# EAGLE schematic senseMini (EAGLE 9.1.1)
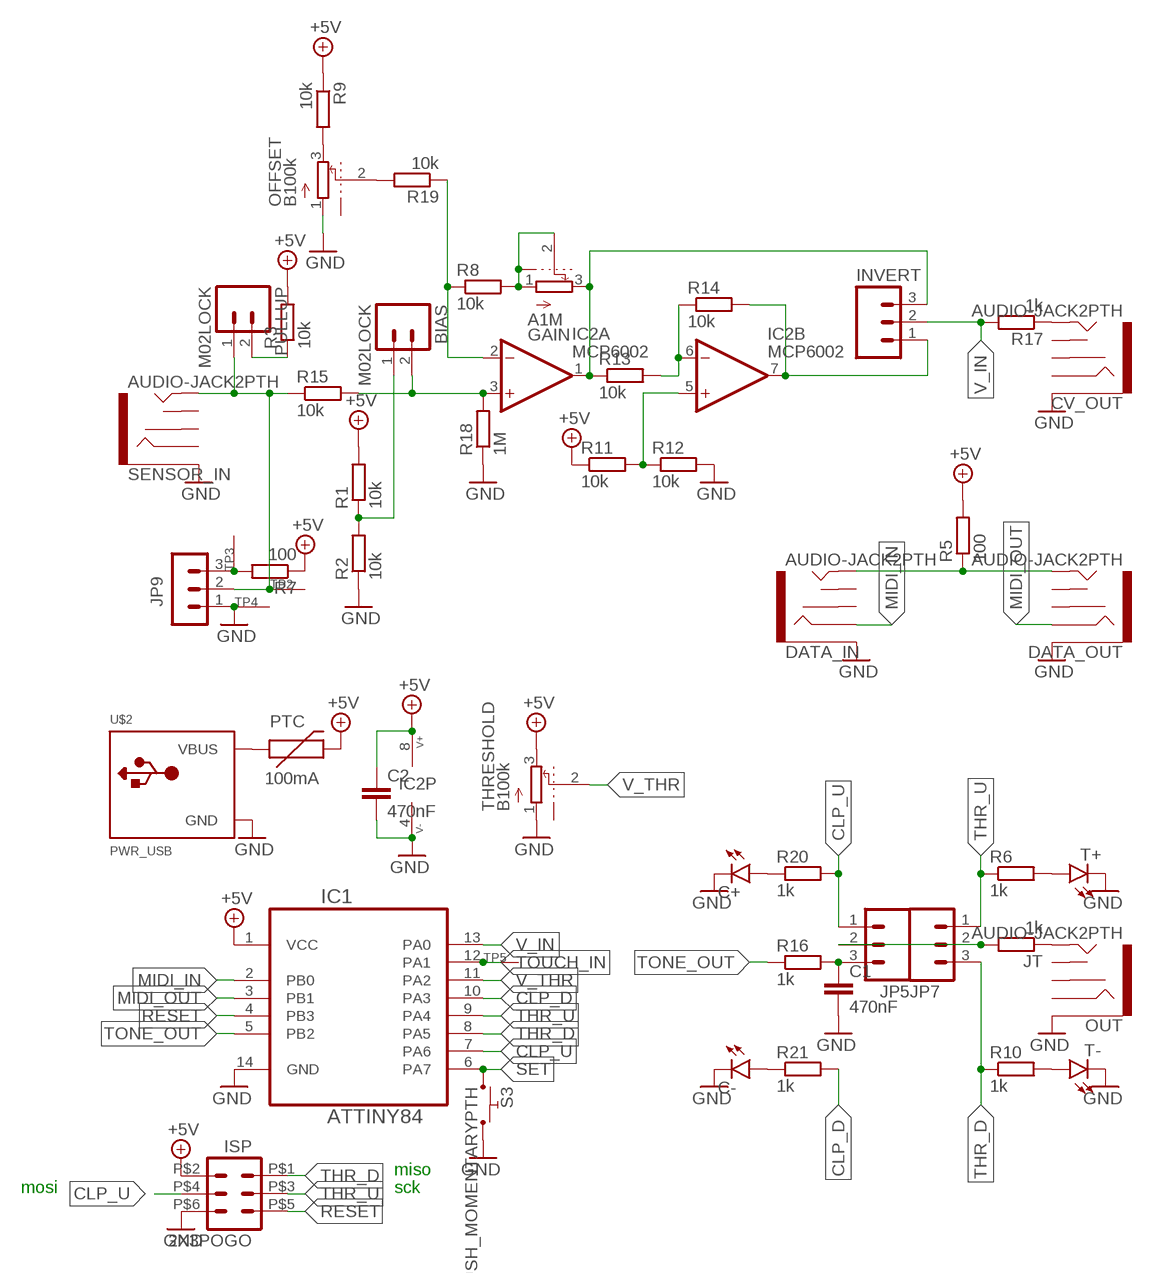
[diagram p0: schematic, sheet 1]

## Parts
BIAS  M02LOCK  [1X02_LOCK]
C1  470nF  CAPACITOR_CERAMIC_THT050-024X044  [C_C050-024X044]
C2  470nF  CAPACITOR_CERAMIC_THT050-024X044  [C_C050-024X044]
C+  LED_THT  [LEDSMALLHOLES]
C-  LED_THT  [LEDSMALLHOLES]
CV_OUT  AUDIO-JACK2PTH  [AUDIO-JACK]
DATA_IN  AUDIO-JACK2PTH  [AUDIO-JACK]
DATA_OUT  AUDIO-JACK2PTH  [AUDIO-JACK]
GAIN  A1M  POT_ALPHAPOT_ALPHA  [POT_ALPHA]
IC1  ATTINY84  ATTINY84-20PU  [DIP254P762X533-14]
IC2  MCP6002  TL072  [DIL08]
INVERT  M03LOCK  [1X03_LOCK]
ISP  2X3POGO  [2X3_POGO]
JP5  M03LOCK  [1X03_LOCK]
JP7  M03LOCK  [1X03_LOCK]
JP9  1X3_FEMALE  [HEADER_1X3_FEMALE]
JT  1k  RESISTOR_0204_THT0204/5  [RCL_0204/5]
OFFSET  B100k  POT_ALPHAPOT_ALPHA  [POT_ALPHA]
OUT  AUDIO-JACK2PTH  [AUDIO-JACK]
PTC  100mA  PTC_THTPTH  [PTC_THT]
PULLUP  M02LOCK  [1X02_LOCK]
R1  10k  RESISTOR_0204_THT0204/5  [RCL_0204/5]
R2  10k  RESISTOR_0204_THT0204/5  [RCL_0204/5]
R3  10k  RESISTOR_0204_THT0204/5  [RCL_0204/5]
R5  100  RESISTOR_0204_THT0204/5  [RCL_0204/5]
R6  1k  RESISTOR_0204_THT0204/5  [RCL_0204/5]
R7  100  RESISTOR_0204_THT0204/5  [RCL_0204/5]
R8  10k  RESISTOR_0204_THT0204/5  [RCL_0204/5]
R9  10k  RESISTOR_0204_THT0204/5  [RCL_0204/5]
R10  1k  RESISTOR_0204_THT0204/5  [RCL_0204/5]
R11  10k  RESISTOR_0204_THT0204/5  [RCL_0204/5]
R12  10k  RESISTOR_0204_THT0204/5  [RCL_0204/5]
R13  10k  RESISTOR_0204_THT0204/5  [RCL_0204/5]
R14  10k  RESISTOR_0204_THT0204/5  [RCL_0204/5]
R15  10k  RESISTOR_0204_THT0204/5  [RCL_0204/5]
R16  1k  RESISTOR_0204_THT0204/5  [RCL_0204/5]
R17  1k  RESISTOR_0204_THT0204/5  [RCL_0204/5]
R18  1M  RESISTOR_0204_THT0204/5  [RCL_0204/5]
R19  10k  RESISTOR_0204_THT0204/5  [RCL_0204/5]
R20  1k  RESISTOR_0204_THT0204/5  [RCL_0204/5]
R21  1k  RESISTOR_0204_THT0204/5  [RCL_0204/5]
S3  PUSH_MOMENTARYPTH  [TACTILE-PTH]
SENSOR_IN  AUDIO-JACK2PTH  [AUDIO-JACK]
T+  LED_THT  [LEDSMALLHOLES]
T-  LED_THT  [LEDSMALLHOLES]
THRESHOLD  B100k  POT_ALPHAPOT_ALPHA  [POT_ALPHA]
TP2  SEWTAP0.5IN  [SEWINGTAP_0.5]
TP3  SEWTAP0.5IN  [SEWINGTAP_0.5]
TP4  SEWTAP0.5IN  [SEWINGTAP_0.5]
TP5  SEWTAP0.5IN  [SEWINGTAP_0.5]
U$2  PWR_USB  [USBMICRO]

## Nets
+5V: C2.1 IC1.1(VCC) IC2.8(P:V+) ISP.P$2 PTC.P$2 R1.2 R3.2 R5.2 R7.1 R9.1 R11.1 THRESHOLD.3
CLP_D: IC1.10(PA3) R21.2
CLP_U: IC1.7(PA6) ISP.P$4 JP5.1 R20.2
GND: C1.2 C2.2 C+.K(C) C-.K(C) CV_OUT.SLEEVE DATA_IN.SLEEVE DATA_OUT.SLEEVE IC1.14(GND) IC2.4(P:V-) ISP.P$6 JP9.1 OFFSET.1 OUT.SLEEVE R2.1 R12.2 R18.1 S3.3 S3.4 SENSOR_IN.SLEEVE T+.K(C) T-.K(C) THRESHOLD.1 TP4.TAP(SEW) U$2.GND U$2.GND1(GND)
MIDI_IN: DATA_IN.RING IC1.2(PB0)
MIDI_OUT: DATA_OUT.RING IC1.3(PB1)
N$1: PTC.P$1 U$2.V+1(VBUS) U$2.V+(VBUS)
N$3: BIAS.1 R1.1 R2.2
N$4: PULLUP.2 R3.1
N$5: C+.A R20.1
N$6: DATA_IN.TIP DATA_OUT.TIP R5.1
N$7: JP9.3 R7.2 TP3.TAP(SEW)
N$8: JP9.2 PULLUP.1 R15.1 SENSOR_IN.TIP TP2.TAP(SEW)
N$9: R6.2 T+.A
N$10: JP5.2 JP7.2 JT.2
N$11: GAIN.3 IC2.1(A:OUT) INVERT.3 R13.1
N$12: C1.1 JP5.3 R16.2
N$13: R10.2 T-.A
N$14: GAIN.1 GAIN.2 GAIN.P$1 GAIN.P$2 R8.2
N$15: BIAS.2 IC2.3(A:+IN) R15.2 R18.2
N$16: OFFSET.3 R9.2
N$17: C-.A R21.1
N$19: IC2.5(B:+IN) R11.2 R12.1
N$20: IC2.6(B:-IN) R13.2 R14.1
N$21: IC2.7(B:OUT) INVERT.1 R14.2
N$23: JT.1 OUT.TIP
N$26: CV_OUT.TIP R17.1
N$27: IC2.2(A:-IN) R8.1 R19.1
N$28: OFFSET.2 R19.2
RESET: IC1.4(PB3) ISP.P$5
SET: IC1.6(PA7) S3.1 S3.2
THR_D: IC1.8(PA5) ISP.P$1 JP7.3 R10.1
THR_U: IC1.9(PA4) ISP.P$3 JP7.1 R6.1
TONE_OUT: IC1.5(PB2) R16.1
TOUCH_IN: IC1.12(PA1) TP5.TAP(SEW)
V_IN: IC1.13(PA0) INVERT.2 R17.2
V_THR: IC1.11(PA2) THRESHOLD.2
Unconnected: CV_OUT.RING CV_OUT.RSH CV_OUT.TSH DATA_IN.RSH DATA_IN.TSH DATA_OUT.RSH DATA_OUT.TSH OFFSET.P$1 OFFSET.P$2 OUT.RING OUT.RSH OUT.TSH SENSOR_IN.RING SENSOR_IN.RSH SENSOR_IN.TSH THRESHOLD.P$1 THRESHOLD.P$2

## Notes on the sheet
- miso
- mosi | sck

## Library data of the parts
BIAS PULLUP = BASTL_PINHEADERS:M02: Standard 2-pin 0.1" header. Use with - straight break away headers ( PRT-00116) - right angle break away headers (PRT-00553) - swiss pins (PRT-00743) - machine pins (PRT-00117) - female headers (PRT-00115) Molex polarized connector foot print use with: PRT-08233 with associated crimp pins and housings. 2.54_SCREWTERM for use with PRT-10571. 3.5mm Screw Terminal footprints for PRT-08084 5mm Screw Terminal footprints for use with PRT-08433
C1 C2 = BASTL_CAPACITORS:CAPACITOR_CERAMIC_THT: CAPACITOR, European symbol
C+ C- T+ T- = BASTL_LEDS:LED_THT: [color]_[diameter]_[difused/clear] R_3mm_D; ASSEMBLED: yes; TYPE: THT
CV_OUT DATA_IN DATA_OUT OUT SENSOR_IN = SparkFun-Connectors:AUDIO-JACK2: Stereo audio jack with bypass switches. SMT version used on LilyPad MP3 board.; PROD_ID: CONN-08774
GAIN OFFSET THRESHOLD = BASTL_POTS:POT_ALPHA: "A/B""value"_"height"_"D(centrer detent)"_"W(white mark)"; ASSEMBLED: yes; TYPE: THT
IC1 = Atmel_By_element14_Batch_1-00:ATTINY84-20PU: 8-bit Microcontroller with In-System Programmable Flash; MPN: ATTINY84-20PU; OC_FARNELL: -; OC_NEWARK: 58M3794; PACKAGE: PDIP-14; SUPPLIER: Atmel
IC2 = BASTL_ICS:TL072
INVERT JP5 JP7 = BASTL_PINHEADERS:M03: Header 3 Standard 3-pin 0.1" header. Use with straight break away headers (SKU : PRT-00116), right angle break away headers (PRT-00553), swiss pins (PRT-00743), machine pins (PRT-00117), and female headers (PRT-00115). Molex polarized connector foot print use with SKU : PRT-08232 with associated crimp pins and housings.
ISP = BASTL_CONNECTORS:2X3POGO
JP9 = BASTL_PINHEADERS:1X3_FEMALE; ASSEMBLED: yes; TYPE: THT
JT R1-R3 R5-R21 = BASTL_RESISTORS:RESISTOR_0204_THT: RESISTOR, European symbol
PTC = BASTL_FUSES:PTC_THT: Resettable Fuse PTC Resettable Fuse. Spark Fun Electronics SKU : COM-08357
S3 = BASTL_SWITCHES:PUSH_MOMENTARY: Various NO switches- pushbuttons, reed, etc; ASSEMBLED: yes; TYPE: THT
TP2-TP5 = adafruit:SEWTAP
U$2 = BASTL_CONNECTORS:PWR_USB; ASSEMBLED: yes; MAN: Amphenol; MPN: 10103593-0001LF; ODOO: USB MICRO 2.0 connector; TYPE: SMT